# Altium schematic sheet BlockDiagram.SchDoc: Wireless security detector
size A3; DrawnBy: Ediz Akbaba; DocumentNumber: 1; Revision: AA; SheetNumber: 1; SheetTotal: 3
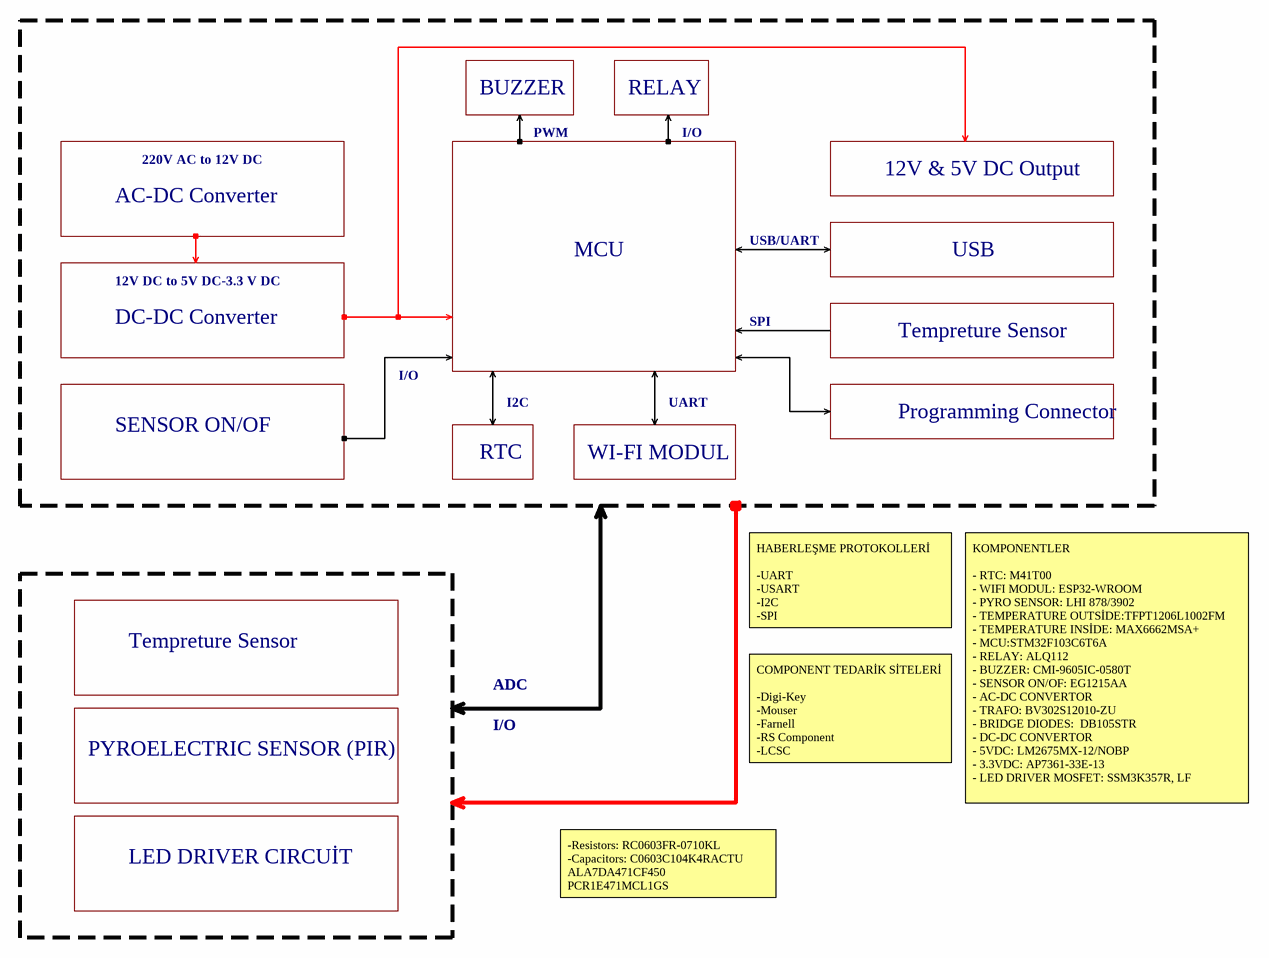
[diagram p0: BlockDiagram.SchDoc]

## Notes on the sheet
- BUZZER
- RELAY
- 220V AC to 12V DC
- PWM
- I/O
- 12V & 5V DC Output
- AC-DC Converter
- MCU
- USB/UART
- USB
- DC-DC Converter
- 12V DC to 5V DC-3.3 V DC
- SPI
- Tempreture Sensor
- SENSOR ON/OF
- RTC
- I2C
- WI-FI MODUL
- UART
- Programming Connector
- HABERLEŞME PROTOKOLLERİ
  -UART
  -USART
  -I2C
  -SPI
- ADC
- PYROELECTRIC SENSOR (PIR)
- COMPONENT TEDARİK SİTELERİ
  -Digi-Key
  -Mouser
  -Farnell
  -RS Component
  -LCSC
- KOMPONENTLER
  - RTC: M41T00
  - WIFI MODUL: ESP32-WROOM
  - PYRO SENSOR: LHI 878/3902
  - TEMPERATURE OUTSİDE:TFPT1206L1002FM
  - TEMPERATURE INSİDE: MAX6662MSA+
  - MCU:STM32F103C6T6A
  - RELAY: ALQ112
  - BUZZER: CMI-9605IC-0580T
  - SENSOR ON/OF: EG1215AA
  - AC-DC CONVERTOR
  - TRAFO: BV302S12010-ZU
  - BRIDGE DIODES:  DB105STR
  - DC-DC CONVERTOR
  - 5VDC: LM2675MX-12/NOBP
  - 3.3VDC: AP7361-33E-13
  - LED DRIVER MOSFET: SSM3K357R, LF
- LED DRIVER CIRCUİT
- -Resistors: RC0603FR-0710KL
  -Capacitors: C0603C104K4RACTU
  ALA7DA471CF450
  PCR1E471MCL1GS